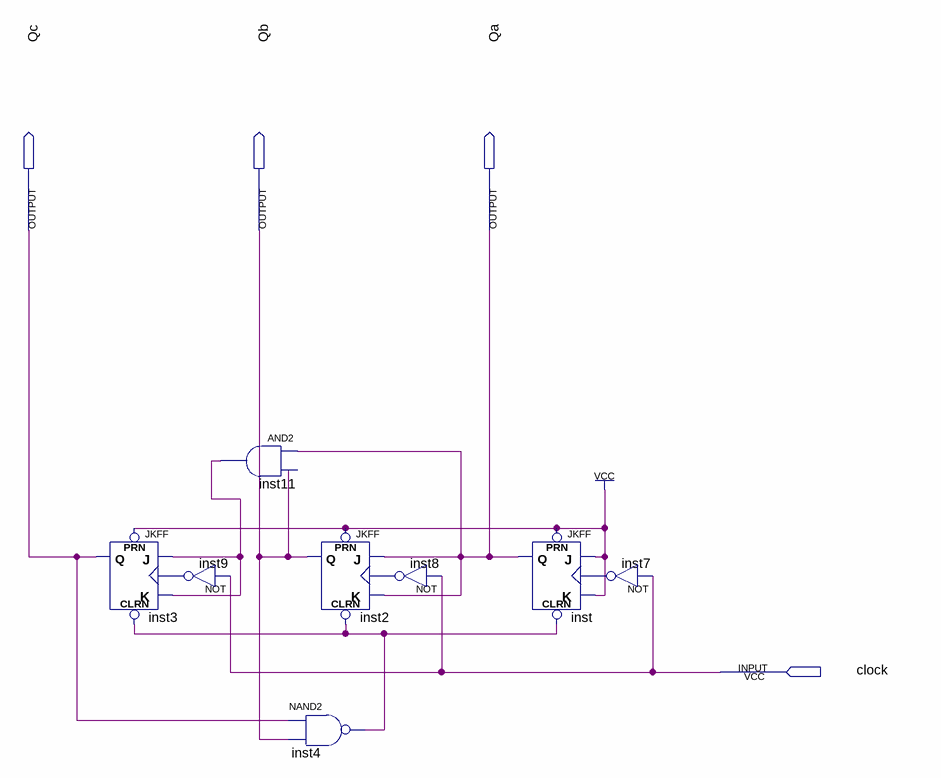
[diagram p0: schematic sheet]
// Quartus schematic Cont5.bdf as structural Verilog: 8 symbols, 4 pins
module Cont5 (
  input  clock,
  output Qc,
  output Qb,
  output Qa
);

  wire inst4_out, inst7_out, inst8_out, inst9_out, inst11_out;

  JKFF inst3 (.PRN(1'b1), .CLRN(inst4_out), .K(inst11_out), .J(inst11_out), .CLK(inst9_out), .Q(Qc));
  not inst9 (inst9_out, clock);
  and inst11 (inst11_out, Qa, Qb);
  JKFF inst2 (.PRN(1'b1), .CLRN(inst4_out), .K(Qa), .J(Qa), .CLK(inst8_out), .Q(Qb));
  nand inst4 (inst4_out, Qc, Qb);
  not inst8 (inst8_out, clock);
  JKFF inst (.PRN(1'b1), .CLRN(inst4_out), .K(1'b1), .J(1'b1), .CLK(inst7_out), .Q(Qa));
  not inst7 (inst7_out, clock);
endmodule
